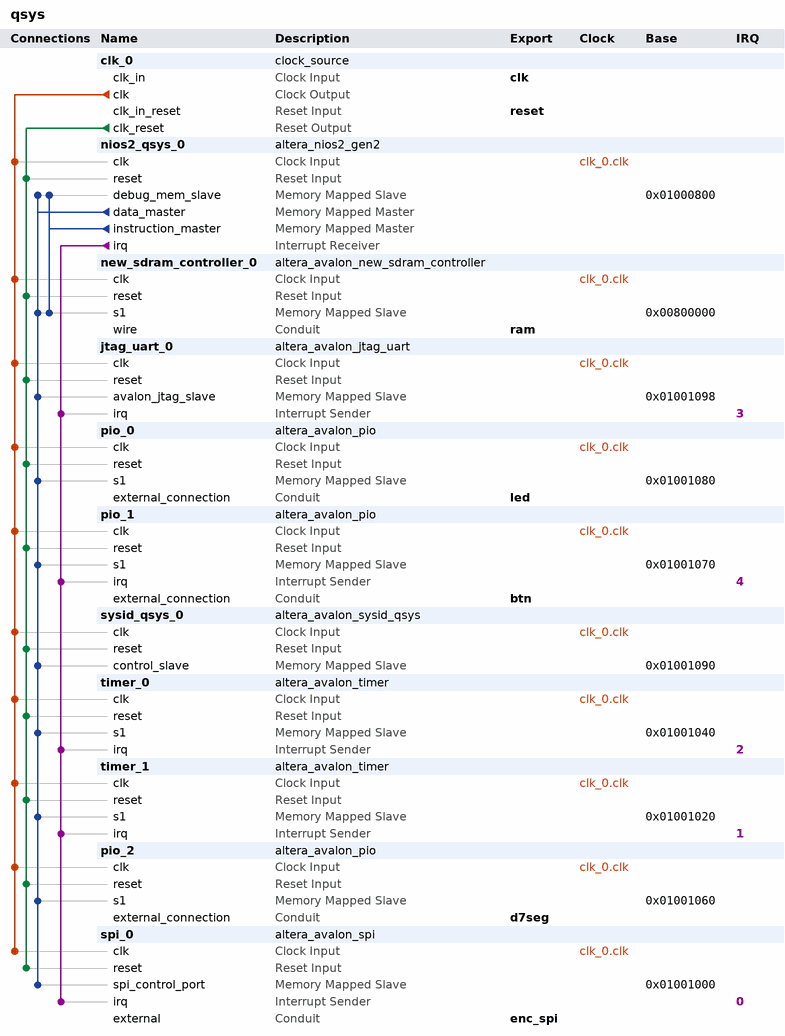
[diagram p0: system contents]
# Platform Designer (Qsys) system qsys, Cyclone IV E EP4CE6E22C8
# Parameters at their usual value, and those the tool derives, are not listed.
package require -exact qsys 20.1
create_system qsys
set_project_property DEVICE_FAMILY {Cyclone IV E}
set_project_property DEVICE EP4CE6E22C8

add_instance clk_0 clock_source 20.1
set_instance_parameter_value clk_0 clockFrequency 50000000

add_instance nios2_qsys_0 altera_nios2_gen2 20.1
set_instance_parameter_value nios2_qsys_0 dcache_size 2048
set_instance_parameter_value nios2_qsys_0 exceptionSlave new_sdram_controller_0.s1
set_instance_parameter_value nios2_qsys_0 icache_size 4096
set_instance_parameter_value nios2_qsys_0 impl Tiny
set_instance_parameter_value nios2_qsys_0 resetSlave new_sdram_controller_0.s1
set_instance_parameter_value nios2_qsys_0 setting_activateTrace true

add_instance new_sdram_controller_0 altera_avalon_new_sdram_controller 20.1
set_instance_parameter_value new_sdram_controller_0 TAC 5.4
set_instance_parameter_value new_sdram_controller_0 TRCD 20.0
set_instance_parameter_value new_sdram_controller_0 TRP 20.0
set_instance_parameter_value new_sdram_controller_0 casLatency 2
set_instance_parameter_value new_sdram_controller_0 columnWidth 8
set_instance_parameter_value new_sdram_controller_0 dataWidth 16
set_instance_parameter_value new_sdram_controller_0 generateSimulationModel false
set_instance_parameter_value new_sdram_controller_0 model single_Micron_MT48LC4M32B2_7_chip
set_instance_parameter_value new_sdram_controller_0 numberOfBanks 4
set_instance_parameter_value new_sdram_controller_0 numberOfChipSelects 1
set_instance_parameter_value new_sdram_controller_0 powerUpDelay 100.0
set_instance_parameter_value new_sdram_controller_0 refreshPeriod 31.25
set_instance_parameter_value new_sdram_controller_0 rowWidth 12

add_instance jtag_uart_0 altera_avalon_jtag_uart 20.1
set_instance_parameter_value jtag_uart_0 simInteractiveOptions NO_INTERACTIVE_WINDOWS

add_instance pio_0 altera_avalon_pio 20.1
set_instance_parameter_value pio_0 direction Output
set_instance_parameter_value pio_0 width 4

add_instance pio_1 altera_avalon_pio 20.1
set_instance_parameter_value pio_1 bitClearingEdgeCapReg true
set_instance_parameter_value pio_1 captureEdge true
set_instance_parameter_value pio_1 direction Input
set_instance_parameter_value pio_1 generateIRQ true
set_instance_parameter_value pio_1 irqType EDGE
set_instance_parameter_value pio_1 width 8

add_instance sysid_qsys_0 altera_avalon_sysid_qsys 20.1
set_instance_parameter_value sysid_qsys_0 id 4660

add_instance timer_0 altera_avalon_timer 20.1
set_instance_parameter_value timer_0 period 10
set_instance_parameter_value timer_0 periodUnits MSEC

add_instance timer_1 altera_avalon_timer 20.1
set_instance_parameter_value timer_1 period 100
set_instance_parameter_value timer_1 periodUnits USEC

add_instance pio_2 altera_avalon_pio 20.1
set_instance_parameter_value pio_2 direction Output
set_instance_parameter_value pio_2 width 16

add_instance spi_0 altera_avalon_spi 20.1
set_instance_parameter_value spi_0 clockPolarity 0
set_instance_parameter_value spi_0 dataWidth 8
set_instance_parameter_value spi_0 masterSPI true
set_instance_parameter_value spi_0 numberOfSlaves 1
set_instance_parameter_value spi_0 targetClockRate 20000000

# connections
add_connection clk_0.clk jtag_uart_0.clk clock
add_connection clk_0.clk new_sdram_controller_0.clk clock
add_connection clk_0.clk nios2_qsys_0.clk clock
add_connection clk_0.clk pio_0.clk clock
add_connection clk_0.clk pio_1.clk clock
add_connection clk_0.clk pio_2.clk clock
add_connection clk_0.clk spi_0.clk clock
add_connection clk_0.clk sysid_qsys_0.clk clock
add_connection clk_0.clk timer_0.clk clock
add_connection clk_0.clk timer_1.clk clock
add_connection clk_0.clk_reset jtag_uart_0.reset reset
add_connection clk_0.clk_reset new_sdram_controller_0.reset reset
add_connection clk_0.clk_reset nios2_qsys_0.reset reset
add_connection clk_0.clk_reset pio_0.reset reset
add_connection clk_0.clk_reset pio_1.reset reset
add_connection clk_0.clk_reset pio_2.reset reset
add_connection clk_0.clk_reset spi_0.reset reset
add_connection clk_0.clk_reset sysid_qsys_0.reset reset
add_connection clk_0.clk_reset timer_0.reset reset
add_connection clk_0.clk_reset timer_1.reset reset
add_connection nios2_qsys_0.data_master jtag_uart_0.avalon_jtag_slave avalon
set_connection_parameter_value nios2_qsys_0.data_master/jtag_uart_0.avalon_jtag_slave baseAddress 0x01001098
add_connection nios2_qsys_0.data_master new_sdram_controller_0.s1 avalon
set_connection_parameter_value nios2_qsys_0.data_master/new_sdram_controller_0.s1 baseAddress 0x00800000
add_connection nios2_qsys_0.data_master nios2_qsys_0.debug_mem_slave avalon
set_connection_parameter_value nios2_qsys_0.data_master/nios2_qsys_0.debug_mem_slave baseAddress 0x01000800
add_connection nios2_qsys_0.data_master pio_0.s1 avalon
set_connection_parameter_value nios2_qsys_0.data_master/pio_0.s1 baseAddress 0x01001080
add_connection nios2_qsys_0.data_master pio_1.s1 avalon
set_connection_parameter_value nios2_qsys_0.data_master/pio_1.s1 baseAddress 0x01001070
add_connection nios2_qsys_0.data_master pio_2.s1 avalon
set_connection_parameter_value nios2_qsys_0.data_master/pio_2.s1 baseAddress 0x01001060
add_connection nios2_qsys_0.data_master spi_0.spi_control_port avalon
set_connection_parameter_value nios2_qsys_0.data_master/spi_0.spi_control_port baseAddress 0x01001000
add_connection nios2_qsys_0.data_master sysid_qsys_0.control_slave avalon
set_connection_parameter_value nios2_qsys_0.data_master/sysid_qsys_0.control_slave baseAddress 0x01001090
add_connection nios2_qsys_0.data_master timer_0.s1 avalon
set_connection_parameter_value nios2_qsys_0.data_master/timer_0.s1 baseAddress 0x01001040
add_connection nios2_qsys_0.data_master timer_1.s1 avalon
set_connection_parameter_value nios2_qsys_0.data_master/timer_1.s1 baseAddress 0x01001020
add_connection nios2_qsys_0.instruction_master new_sdram_controller_0.s1 avalon
set_connection_parameter_value nios2_qsys_0.instruction_master/new_sdram_controller_0.s1 baseAddress 0x00800000
add_connection nios2_qsys_0.instruction_master nios2_qsys_0.debug_mem_slave avalon
set_connection_parameter_value nios2_qsys_0.instruction_master/nios2_qsys_0.debug_mem_slave baseAddress 0x01000800
add_connection nios2_qsys_0.irq jtag_uart_0.irq interrupt
set_connection_parameter_value nios2_qsys_0.irq/jtag_uart_0.irq irqNumber 3
add_connection nios2_qsys_0.irq pio_1.irq interrupt
set_connection_parameter_value nios2_qsys_0.irq/pio_1.irq irqNumber 4
add_connection nios2_qsys_0.irq spi_0.irq interrupt
set_connection_parameter_value nios2_qsys_0.irq/spi_0.irq irqNumber 0
add_connection nios2_qsys_0.irq timer_0.irq interrupt
set_connection_parameter_value nios2_qsys_0.irq/timer_0.irq irqNumber 2
add_connection nios2_qsys_0.irq timer_1.irq interrupt
set_connection_parameter_value nios2_qsys_0.irq/timer_1.irq irqNumber 1

# exported interfaces
add_interface btn conduit end
set_interface_property btn EXPORT_OF pio_1.external_connection
add_interface clk clock sink
set_interface_property clk EXPORT_OF clk_0.clk_in
add_interface d7seg conduit end
set_interface_property d7seg EXPORT_OF pio_2.external_connection
add_interface enc_spi conduit end
set_interface_property enc_spi EXPORT_OF spi_0.external
add_interface led conduit end
set_interface_property led EXPORT_OF pio_0.external_connection
add_interface ram conduit end
set_interface_property ram EXPORT_OF new_sdram_controller_0.wire
add_interface reset reset sink
set_interface_property reset EXPORT_OF clk_0.clk_in_reset

set_interconnect_requirement {$system} qsys_mm.clockCrossingAdapter HANDSHAKE
set_interconnect_requirement {$system} qsys_mm.enableEccProtection FALSE
set_interconnect_requirement {$system} qsys_mm.insertDefaultSlave FALSE
set_interconnect_requirement {$system} qsys_mm.maxAdditionalLatency 1

save_system qsys.qsys
